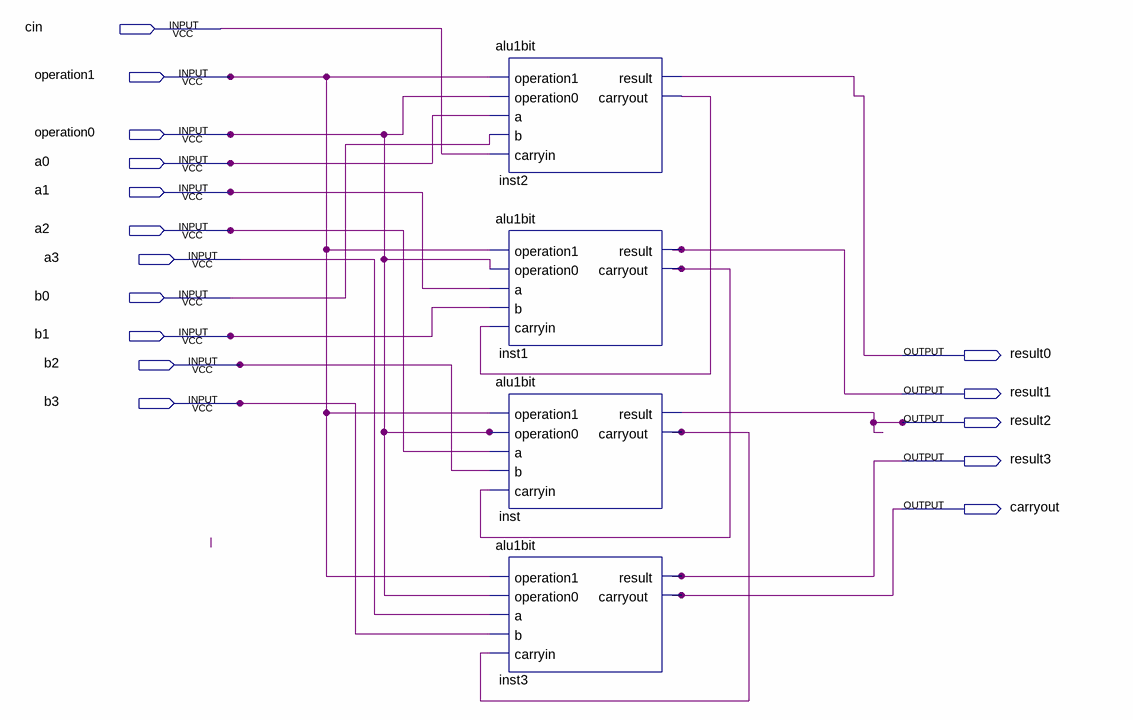
[diagram p0: schematic sheet]
// Quartus schematic alu4bit (2).bdf as structural Verilog: 4 symbols, 16 pins
module \alu4bit_(2)  (
  input  cin,
  input  operation1,
  input  operation0,
  input  a0,
  input  a1,
  input  a2,
  input  a3,
  input  b0,
  input  b1,
  input  b2,
  input  b3,
  output result0,
  output result1,
  output result2,
  output result3,
  output carryout
);

  wire inst1_carryout, inst2_carryout, inst_carryout;

  alu1bit inst2 (
    .operation1(operation1), .operation0(operation0), .a(a0), .b(b0), .carryin(cin), .result(result0),
    .carryout(inst2_carryout));
  alu1bit inst1 (
    .operation1(operation1), .operation0(operation0), .a(a1), .b(b1), .carryin(inst2_carryout),
    .result(result1), .carryout(inst1_carryout));
  alu1bit inst (
    .operation1(operation1), .operation0(operation0), .a(a2), .b(b2), .carryin(inst1_carryout),
    .result(result2), .carryout(inst_carryout));
  alu1bit inst3 (
    .operation1(operation1), .operation0(operation0), .a(a3), .b(b3), .carryin(inst_carryout),
    .result(result3), .carryout(carryout));
endmodule
